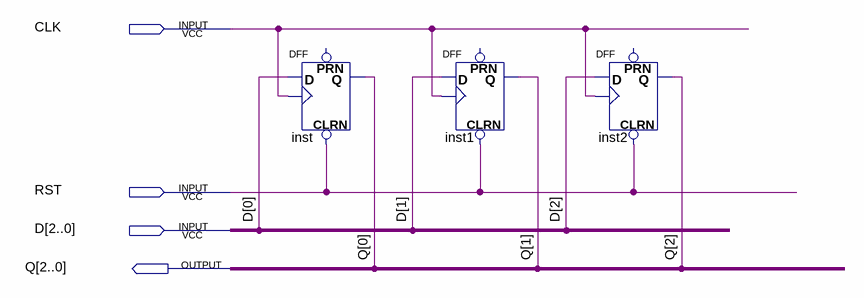
[diagram p0: schematic sheet]
// Quartus schematic DFF3.bdf as structural Verilog: 3 symbols, 4 pins
module DFF3 (
  input  CLK,
  input  RST,
  input  [2:0] D,
  output [2:0] Q
);

  DFF inst (.CLRN(RST), .CLK(CLK), .D(D[0]), .Q(Q[0]));  // open: PRN
  DFF inst1 (.CLRN(RST), .CLK(CLK), .D(D[1]), .Q(Q[1]));  // open: PRN
  DFF inst2 (.CLRN(RST), .CLK(CLK), .D(D[2]), .Q(Q[2]));  // open: PRN
endmodule
